# EAGLE design MT3608-dip-board (EAGLE 8.3.1)
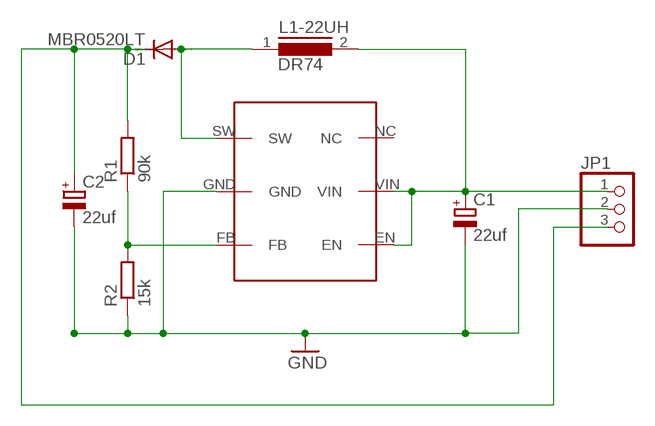
[diagram p0: schematic, sheet 1]

## Parts
C1  22uf  CPOL-EUC/6032-28R  [C/6032-28R]
C2  22uf  CPOL-EUC/6032-28R  [C/6032-28R]
D1  MBR0520LT  [SOD123]
JP1  PINHD-1X3  [1X03]
L1-22UH  DR74  [DR74]
R1  90k  R-EU_R0805  [R0805]
R2  15k  R-EU_R0805  [R0805]
U$1  MT3608  [MT3608]

## Nets
GND: C1.- C2.- JP1.2 R2.1 U$1.GND
N$1: C1.+ JP1.1 L1-22UH.2 U$1.EN U$1.VIN
N$3: D1.A L1-22UH.1 U$1.SW
N$4: C2.+ D1.C JP1.3 R1.2
N$5: R1.1 R2.2 U$1.FB
Unconnected: U$1.NC

## Library data of the parts
C1 C2 = resistor:CPOL-EU: POLARIZED CAPACITOR, European symbol
D1 = diode:MBR0520LT: SCHOTTKY BARRIER RECTIFIER Source: http://onsemi.com .. MBR0520LT1-D.pdf
JP1 = adafruit:PINHD-1X3: PIN HEADER
L1-22UH = inductors:DR74: High Power Density, High Efficiency, Shielded Inductors Source: coiltronics_dr_series.pdf
R1 R2 = resistor:R-EU_: RESISTOR, European symbol
U$1 = mgvc:MT3608: DC-DC step-up Входное напряжение: от 2V до 24V Фиксированная частота преобразования 1.2MHz Внутренний 4A ключ

## Board
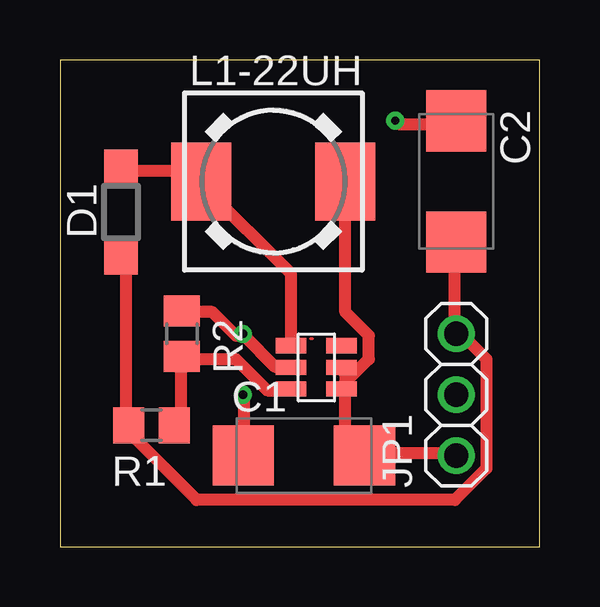
[diagram p1: board, top side]
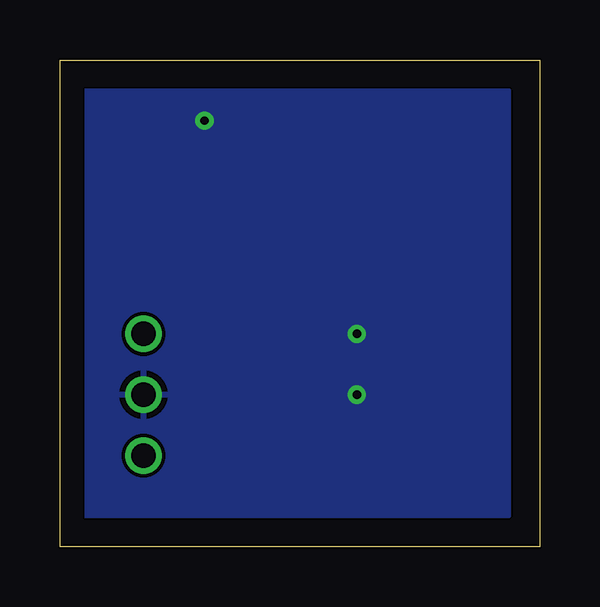
[diagram p2: board, bottom side, seen from below]

Size 19.99 x 20.31 mm. Coordinates in mm from the lower left corner, seen from the top.
Outline: 0,0 19.99,0 19.99,20.31 0,20.31 0,0
Copper layers (1*16): Top 0.035mm / dielectric 1.5mm / Bottom 0.035mm
Design rules "default *": minimum track width 0.5mm, minimum drill 0.35mm, track to track 6mil, track to pad 6mil, pad to pad 6mil, via to via 6mil, smd to smd 6mil, copper to edge 40mil, drill to drill 6mil, minimum pad ring 10mil, minimum via ring 8mil, stop-mask expansion 4mil, vias tented up to drill 0mil, thermal gap 10mil

### Footprints (pad centres in the part's own frame; a part is rotated, then mirrored left to right if it is on the bottom)
C/6032-28R = smd 2.55 x 2.5: + 2.525,0; - -2.525,0
SOD123 = smd 1.4 x 1.4: A 1.9,0; C -1.9,0
1X03 = drill 1.016: 1 -2.54,0; 2 0,0; 3 2.54,0
DR74 = smd 2.5 x 3.25: 1 -3,0; 2 3,0
R0805 = smd 1.3 x 1.5: 1 -0.95,0; 2 0.95,0
MT3608 = smd 0.635 x 1.27: EN 2.3,0.3; FB 2.3,-1.8; GND 1.4,-1.8; NC 0.5,0.3; SW 0.5,-1.8; VIN 1.4,0.3

### Placement (x,y rotation side)
C1  10.16,3.81 0 top
C2  16.51,15.24 270 top
D1  2.54,13.97 90 top
JP1  16.51,6.35 90 top
L1-22UH  8.89,15.24 0 top
R1  3.81,5.08 180 top
R2  5.08,8.89 270 top
U$1  11.43,8.89 270 top

### Tracks (layer width: path | path; a pad name or v marks a point on that pad's centre or on a via)
GND  (via drill 0.35)
  Top 0.5: U$1.GND 9.61,7.51 8.95,7.51 7.65,8.82 v7.62,8.89 7.32,8.82 6.35,9.79 5.37,9.79 R2.1 | C1.- 7.65,3.92 7.65,6.21 v7.62,6.35 | C2.- 16.46,17.62 14.17,17.62 v13.97,17.78
  pour Bottom: 19.05,19.05 1.27,19.05 1.27,1.27 19.05,1.27
N$1
  Top 0.5: 11.89,6.86 11.89,7.19 U$1.VIN | JP1.1 16.46,3.92 12.87,3.92 C1.+ 12.54,3.92 11.89,4.58 11.89,6.53 U$1.EN 11.89,6.86 | 11.89,6.86 12.87,7.84 12.87,8.82 11.89,9.79 11.89,15.01 L1-22UH.2
N$3
  Top 0.5: U$1.SW 9.61,8.49 9.61,11.43 6.02,15.01 L1-22UH.1 5.69,15.34 5.37,15.67 2.76,15.67 D1.A
N$4
  Top 0.5: D1.C 2.76,11.75 2.76,5.23 R1.2 3.08,4.9 3.08,4.58 5.69,1.97 16.46,1.97 17.76,3.27 17.76,7.84 16.78,8.82 JP1.3 16.46,9.14 16.46,12.4 C2.+
N$5
  Top 0.5: U$1.FB 9.61,6.53 8.63,6.53 7.32,7.84 5.37,7.84 R2.2 5.04,7.84 5.04,5.23 R1.1